# EAGLE design FSR-Sensor (EAGLE 9.5.0)
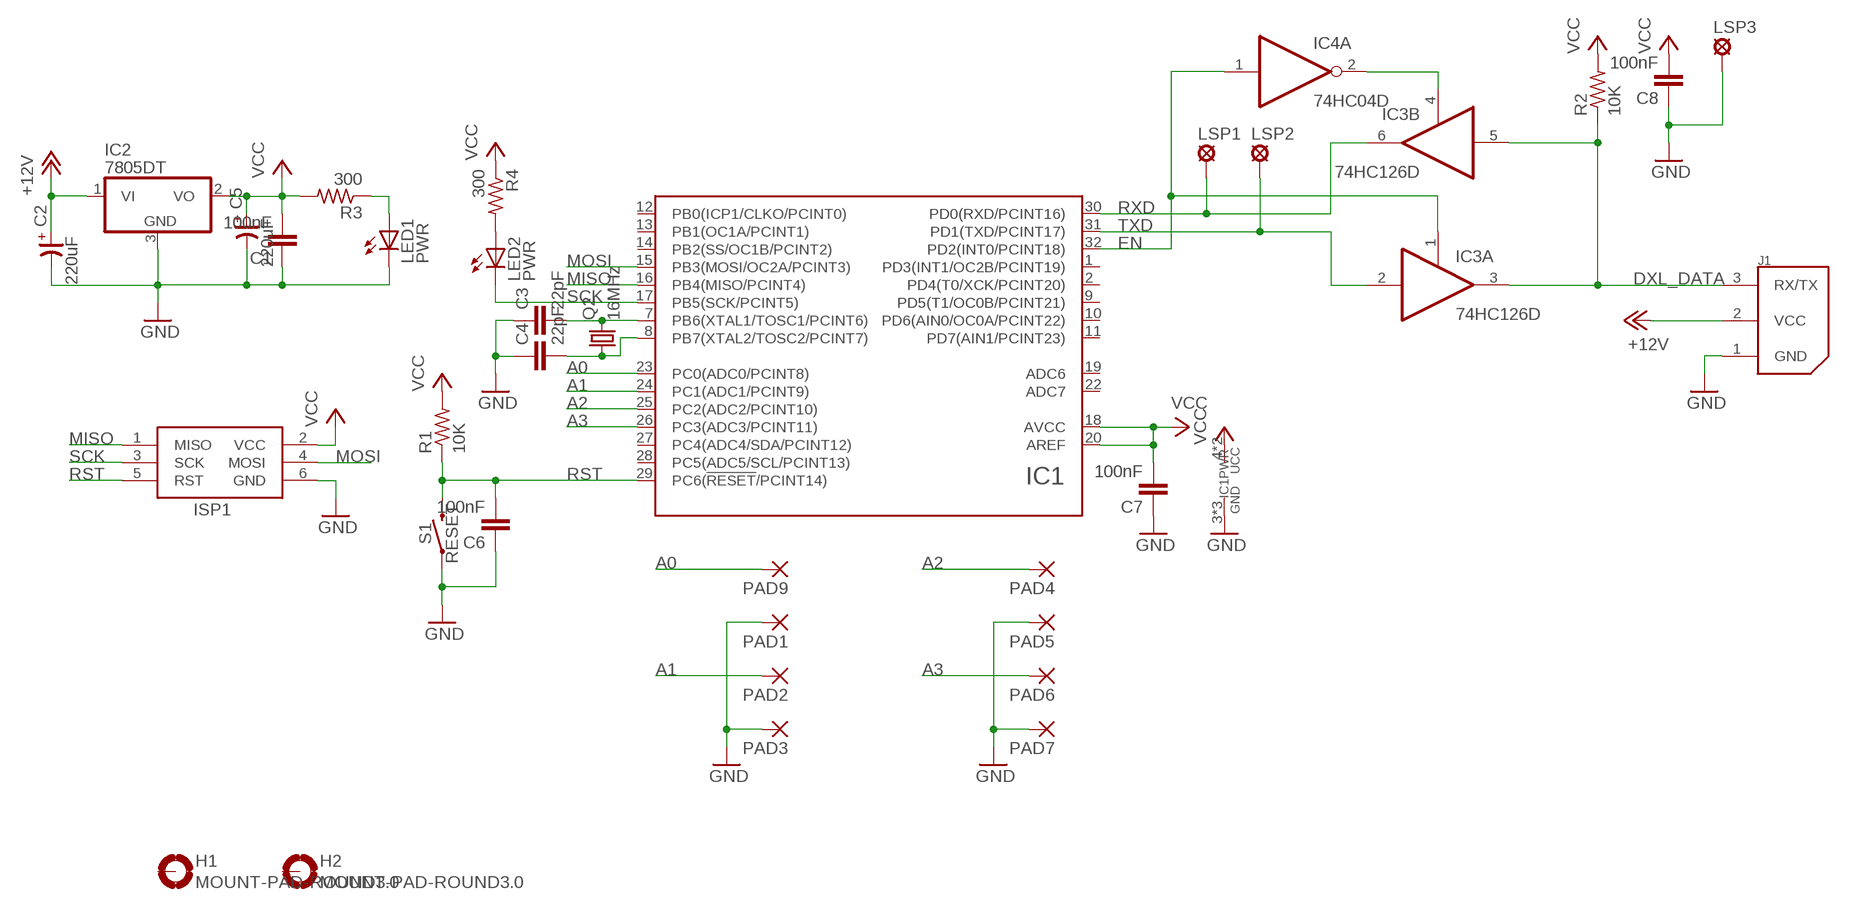
[diagram p0: schematic, sheet 1]

## Parts
C1  100nF  C-EUC0805K  [C0805K]
C2  220uF  CP-7343  [7343/T]
C3  22pF  C-EUC0805K  [C0805K]
C4  22pF  C-EUC0805K  [C0805K]
C5  220uF  CP-7343  [7343/T]
C6  100nF  C-EUC0805K  [C0805K]
C7  100nF  C-EUC0805K  [C0805K]
C8  100nF  C-EUC0805K  [C0805K]
H1  MOUNT-PAD-ROUND3.0  [3,0-PAD]
H2  MOUNT-PAD-ROUND3.0  [3,0-PAD]
IC1  ATMEGA48/88/168/328-AU  [TQFP32-08]
IC2  7805DT  [TO252]
IC3  74HC126D  [SO14]
IC4  74HC04D  [SO14]
ISP1  AVRISP-6  [AVRISP]
J1  22-03-5035  [5267-3]
LED1  PWR  LEDCHIP-LED0805  [CHIP-LED0805]
LED2  PWR  LEDCHIP-LED0805  [CHIP-LED0805]
LSP1  LSP10  [LSP10]
LSP2  LSP10  [LSP10]
LSP3  LSP10  [LSP10]
PAD1  SMD2  [SMD1,27-2,54]
PAD2  SMD2  [SMD1,27-2,54]
PAD3  SMD2  [SMD1,27-2,54]
PAD4  SMD2  [SMD1,27-2,54]
PAD5  SMD2  [SMD1,27-2,54]
PAD6  SMD2  [SMD1,27-2,54]
PAD7  SMD2  [SMD1,27-2,54]
PAD9  SMD2  [SMD1,27-2,54]
Q2  16MHz  CRYSTALHC49UP  [HC49UP]
R1  10K  R-US_R0805  [R0805]
R2  10K  R-US_R0805  [R0805]
R3  300  R-US_R0805  [R0805]
R4  300  R-US_R0805  [R0805]
S1  RESET  MOMENTARY-SWITCH-SPST-SMD-6.0X3.5MM  [TACTILE_SWITCH_SMD_6.0X3.5MM]

## Nets
+12V: C2.+ IC2.1(VI) J1.2(VCC)
A0: IC1.23(PC0(ADC0/PCINT8)) PAD9.1(P)
A1: IC1.24(PC1(ADC1/PCINT9)) PAD2.1(P)
A2: IC1.25(PC2(ADC2/PCINT10)) PAD4.1(P)
A3: IC1.26(PC3(ADC3/PCINT11)) PAD6.1(P)
DXL_DATA: IC3.3(A:O) IC3.5(B:I) J1.3(RX/TX) R2.1
EN: IC1.32(PD2(INT0/PCINT18)) IC3.1(A:OE) IC4.1(A:I)
GND: C1.1 C2.- C3.1 C4.1 C5.- C6.1 C7.1 C8.1 IC1.3(GND) IC1.5(GND) IC1.21(GND) IC2.3(GND) ISP1.6(GND) J1.1(GND) LED1.C LSP3.MP PAD1.1(P) PAD3.1(P) PAD5.1(P) PAD7.1(P) S1.1
MISO: IC1.16(PB4(MISO/PCINT4)) ISP1.1(MISO)
MOSI: IC1.15(PB3(MOSI/OC2A/PCINT3)) ISP1.4(MOSI)
N$1: C3.2 IC1.7(PB6(XTAL1/TOSC1/PCINT6)) Q2.2
N$2: C4.2 IC1.8(PB7(XTAL2/TOSC2/PCINT7)) Q2.1
N$3: LED1.A R3.1
N$4: LED2.A R4.2
N$6: IC3.4(B:OE) IC4.2(A:O)
RST: C6.2 IC1.29(PC6(!RESET!/PCINT14)) ISP1.5(RST) R1.1 S1.2
RXD: IC1.30(PD0(RXD/PCINT16)) IC3.6(B:O) LSP1.MP
SCK: IC1.17(PB5(SCK/PCINT5)) ISP1.3(SCK) LED2.C
TXD: IC1.31(PD1(TXD/PCINT17)) IC3.2(A:I) LSP2.MP
VCC: C1.2 C5.+ C7.2 C8.2 IC1.4(UCC) IC1.6(UCC) IC1.18(AVCC) IC1.20(AREF) IC2.2(VO) ISP1.2(VCC) R1.2 R2.2 R3.2 R4.1
Unconnected: H1.B3,0(MOUNT) H2.B3,0(MOUNT) IC1.1(PD3(INT1/OC2B/PCINT19)) IC1.2(PD4(T0/XCK/PCINT20)) IC1.9(PD5(T1/OC0B/PCINT21)) IC1.10(PD6(AIN0/OC0A/PCINT22)) IC1.11(PD7(AIN1/PCINT23)) IC1.12(PB0(ICP1/CLKO/PCINT0)) IC1.13(PB1(OC1A/PCINT1)) IC1.14(PB2(SS/OC1B/PCINT2)) IC1.19(ADC6) IC1.22(ADC7) IC1.27(PC4(ADC4/SDA/PCINT12)) IC1.28(PC5(ADC5/SCL/PCINT13)) IC3.8(C:O) IC3.9(C:I) IC3.10(C:OE) IC3.11(D:O) IC3.12(D:I) IC3.13(D:OE) IC4.3(B:I) IC4.4(B:O) IC4.5(C:I) IC4.6(C:O) IC4.8(D:O) IC4.9(D:I) IC4.10(E:O) IC4.11(E:I) IC4.12(F:O) IC4.13(F:I)

## Power pins joined to a net without a drawn wire
GND: IC3.7(P:GND) IC4.7(P:GND)
VCC: IC3.14(P:VCC) IC4.14(P:VCC)

## Library data of the parts
C1 C3 C4 C6-C8 = rcl:C-EU: CAPACITOR, European symbol; SPICEPREFIX: C
C2 C5 = cap-master:CP-: POLARIZED CAP
H1 H2 = holes:MOUNT-PAD-ROUND: MOUNTING PAD, round
IC1 = atmel_tiny24-44-84tiny48-88mega48-88-168-328:ATMEGA48/88/168/328
IC2 = linear:78*: Positive VOLTAGE REGULATOR Source: http://cache.national.com/ds/LM/LM78L05.pdf http://www.fairchildsemi.com/ds/LM/LM7805.pdf
IC3 = 74xx-eu:74*126: Quad bus BUFFER, 3-state
IC4 = 74xx-eu:74*04: Hex INVERTER
ISP1 = adafruit:AVRISP: AVR ISP HEADER Standard 6 pin header for AVR programming
J1 = molex:22-03-5035: Molex SPOX Vert, Tin (Dynamixel AX/MX Bus) tested: YES (arbotix)
LED1 LED2 = adafruit:LED: LED OSRAM: - CHIPLED LG R971, LG N971, LY N971, LG Q971, LY Q971, LO R971, LY R971 LH N974, LH R974 LS Q976, LO Q976, LY Q976 LO Q996 - Hyper CHIPLED LW Q18S LB Q993, LB Q99A, LB R99A - SideLED LS A670, LO A670, LY A670, LG A670, LP A670 LB A673, LV A673, LT A673, LW A673 LH A674 LY A675 LS A676, LA A676, LO A676, LY A676, LW A676 LS A679, LY A679, LG A679 - Hyper Micro SIDELED® LS Y876, LA Y876, LO Y876, LY Y876 LT Y87S - SmartLED LW L88C, LW L88S LB L89C, LB L89S, LG L890 LS L89K, LO L89K, LY L89K LS L896, LA L896, LO L896, LY L896 - TOPLED LS T670, LO T670, LY T670, LG T670, LP T670 LSG T670, LSP T670, LSY T670, LOP T670, LYG T670 LG T671, LOG T671, LSG T671 LB T673, LV T673, LT T673, LW T673 LH T674 LS T676, LA T676, LO T676, LY T676, LB T676, LH T676, LSB T676, LW T676 LB T67C, LV T67C, LT T67C, LS T67K, LO T67K, LY T67K, LW E67C LS E67B, LA E67B, LO E67B, LY E67B, LB E67C, LV E67C, LT E67C LW T67C LS T679, LY T679, LG T679 LS T770, LO T770, LY T770, LG T770, LP T770 LB T773, LV T773, LT T773, LW T773 LH T774 LS E675, LA E675, LY E675, LS T675 LS T776, LA T776, LO T776, LY T776, LB T776 LHGB T686 LT T68C, LB T68C - Hyper Mini TOPLED® LB M676 - Mini TOPLED Santana® LG M470 LS M47K, LO M47K, LY M47K Source: http://www.osram.convergy.de/
LSP1-LSP3 = solpad:LSP10: SOLDER PAD drill 1.0 mm, distributor Buerklin, 12H555
PAD1-PAD7 PAD9 = wirepad:SMD2: SMD PAD
Q2 = crystal:CRYSTAL: CRYSTAL; OC_FARNELL: unknown; OC_NEWARK: unknown
R1-R4 = rcl:R-US_: RESISTOR, American symbol; SPICEPREFIX: R
S1 = SparkFun-Switches:MOMENTARY-SWITCH-SPST: Momentary Switch (Pushbutton) - SPST Normally-open (NO) SPST momentary switches (buttons, pushbuttons). Variants PTH-12MM - 12mm square, through-hole Momentary Pushbutton Switch - 12mm Square <https://www.sparkfun.com/products/9190> (COM-09190) PTH-6.0MM, PTH-6.0MM-KIT - 6.0mm square, through-hole Mini Pushbutton Switch <https://www.sparkfun.com/products/97> (COM-00097) KIT package intended for soldering kit's - only one side of pads' copper is exposed. PTH-RIGHT-ANGLE-KIT - Right-angle, through-hole Right Angle Tactile Button <https://www.sparkfun.com/products/10791> - Used on SparkFun BigTime Watch Kit <https://www.sparkfun.com/products/11734> SMD-12MM - 12mm square, surface-mount Tactile Button - SMD (12mm) <https://www.sparkfun.com/products/12993> (COM-12993) Used on SparkFun PicoBoard <https://www.sparkfun.com/products/11888> SMD-4.5MM - 4.5mm Square Trackball Switch Used on SparkFun Blackberry Trackballer Breakout <https://www.sparkfun.com/products/13169> SMD-4.6MMX2.8MM - 4.60mm x 2.80mm, surface mount Used on SparkFun SAMD21 Mini Breakout <https://www.sparkfun.com/products/13664> SMD-5.2MM, SMD-5.2-REDUNDANT - 5.2mm square, surface-mount Mini Pushbutton Switch - SMD <https://www.sparkfun.com/products/8720> (COM-08720) Used on Arduino Pro Mini <https://www.sparkfun.com/products/11114> REDUNDANT package connects both switch circuits together SMD-6.0X3.5MM - 6.0 x 3.5mm, surface mount Momentary Reset Switch SMD <https://www.sparkfun.com/products/8229> (COM-08229) SMD-6.2MM-TALL - 6.2mm square, surface mount Tactile Button - SMD (6mm) <https://www.sparkfun.com/products/12992> Used on SparkFun Digital Sandbox <https://www.sparkfun.com/products/12651> SMD-RIGHT-ANGLE - Right-angle, surface mount Used on SparkFun Block for Intel® Edison - Arduino <https://www.sparkfun.com/products/13036>; PROD_ID: SWCH-00815; SF_SKU: COM-08229

## Board
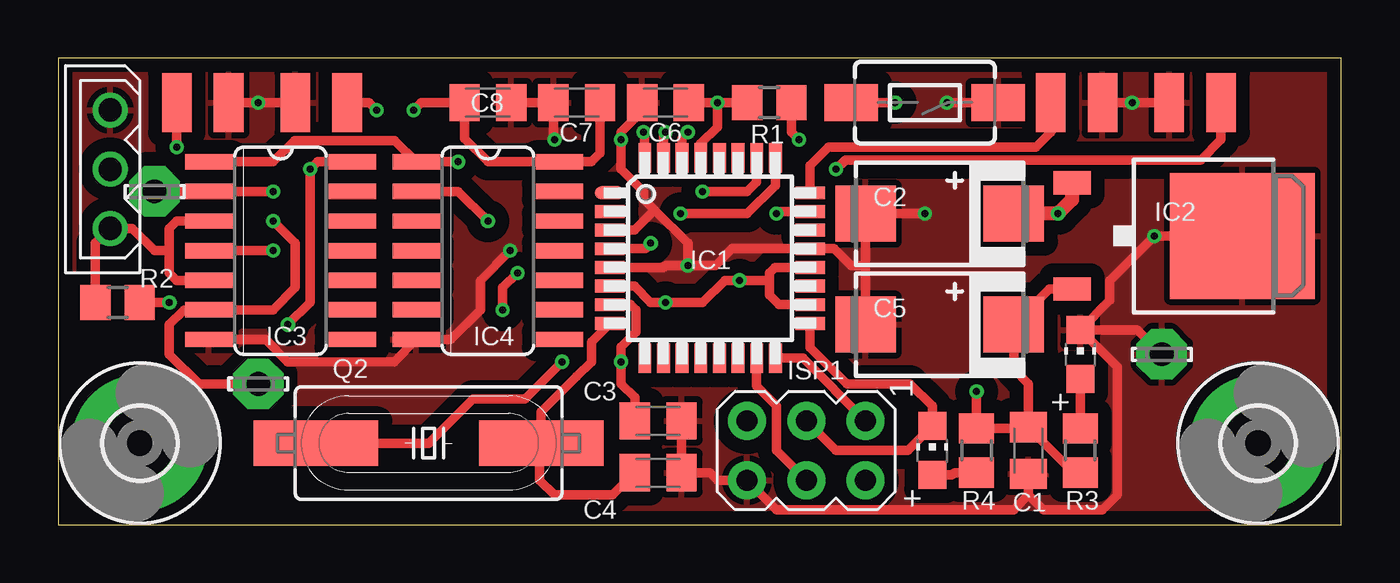
[diagram p1: board, top side]
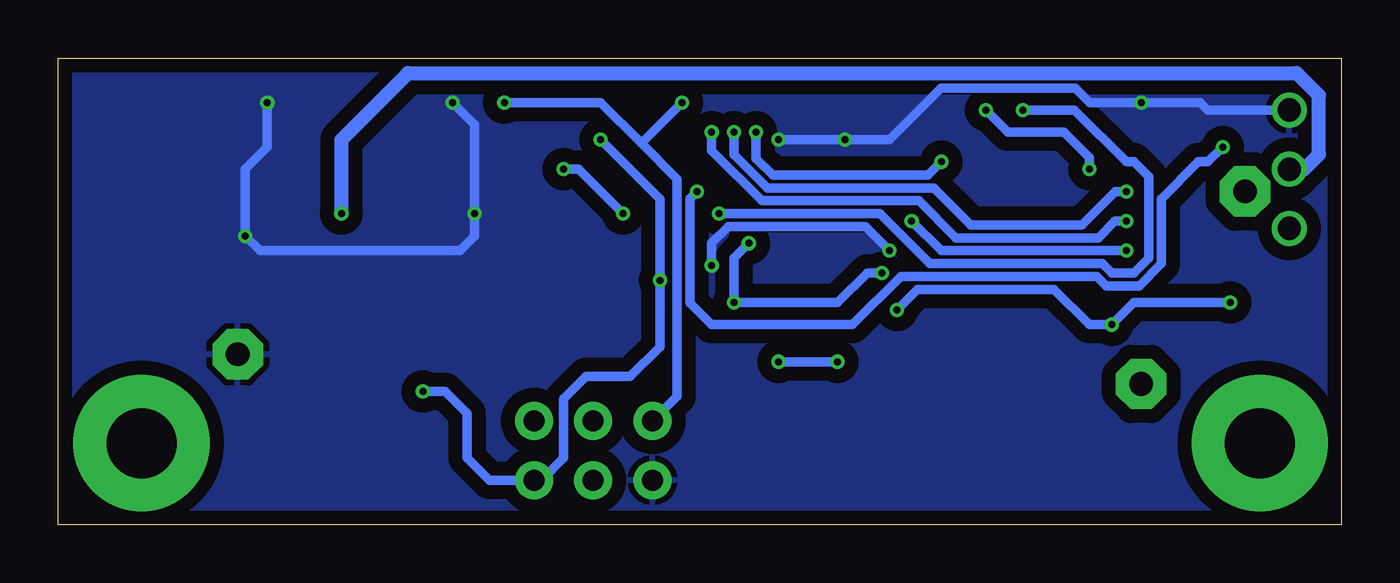
[diagram p2: board, bottom side, seen from below]

Size 55 x 20 mm. Coordinates in mm from the lower left corner, seen from the top.
Outline: 0,0 55,0 55,20 0,20 0,0
Copper layers (1*16): Top 0.035mm / dielectric 1.5mm / Bottom 0.035mm
Design rules "SparkFun-2-layer-PCBWay-LIMIT": minimum track width 6mil, minimum drill 0.3mm, track to track 6mil, track to pad 6mil, pad to pad 6mil, via to via 6mil, smd to smd 6mil, copper to edge 6mil, drill to drill 6mil, minimum pad ring 6mil, minimum via ring 6mil, stop-mask expansion 4mil, vias tented up to drill 25mil, thermal gap 10mil

### Footprints (pad centres in the part's own frame; a part is rotated, then mirrored left to right if it is on the bottom)
C0805K = smd 1.3 x 1.6: 1 -1,0; 2 1,0
7343/T = smd 2.6 x 2.4: + 3.175,0; - -3.175,0
3,0-PAD = drill 3 pad 5.842: B3,0 0,0
TQFP32-08 = smd 1.27 x 0.55: 1 -4.293,2.8; 2 -4.293,2; 3 -4.293,1.2; 4 -4.293,0.4; 5 -4.293,-0.4; 6 -4.293,-1.2; 7 -4.293,-2; 8 -4.293,-2.8; 17 4.293,-2.8; 18 4.293,-2; 19 4.293,-1.2; 20 4.293,-0.4; 21 4.293,0.4; 22 4.293,1.2; 23 4.293,2; 24 4.293,2.8 | smd 0.55 x 1.27: 9 -2.8,-4.293; 10 -2,-4.293; 11 -1.2,-4.293; 12 -0.4,-4.293; 13 0.4,-4.293; 14 1.2,-4.293; 15 2,-4.293; 16 2.8,-4.293; 25 2.8,4.293; 26 2,4.293; 27 1.2,4.293; 28 0.4,4.293; 29 -0.4,4.293; 30 -1.2,4.293; 31 -2,4.293; 32 -2.8,4.293
TO252 = smd 1 x 1.6: 1 -2.28,-4.8; 2 2.28,-4.8 | smd 5.4 x 6.2: 3 0,2.5
SO14 = smd 0.66 x 2.032: 1 -3.81,-3.073; 2 -2.54,-3.073; 3 -1.27,-3.073; 4 0,-3.073; 5 1.27,-3.073; 6 2.54,-3.073; 7 3.81,-3.073; 8 3.81,3.073; 9 2.54,3.073; 10 1.27,3.073; 11 0,3.073; 12 -1.27,3.073; 13 -2.54,3.073; 14 -3.81,3.073
AVRISP = drill 0.9 pad 1.626: 1 -1.27,2.54; 2 1.27,2.54; 3 -1.27,0; 4 1.27,0; 5 -1.27,-2.54; 6 1.27,-2.54
5267-3 = drill 1: 1 0,0; 2 -2.54,0; 3 -5.08,0
CHIP-LED0805 = smd 1.2 x 1.2: A 0,-1.05; C 0,1.05
LSP10 = drill 1.016 pad 2.159 octagon: MP 0,0
SMD1,27-2,54 = smd 1.27 x 2.54: 1 0,0
HC49UP = smd 5.334 x 1.93: 1 -4.826,0; 2 4.826,0
R0805 = smd 1.3 x 1.5: 1 -0.95,0; 2 0.95,0
TACTILE_SWITCH_SMD_6.0X3.5MM = smd 2.3 x 1.6: 1 -3.15,0; 2 3.15,0

### Placement (x,y rotation side)
C1  41.59,3.17 90 top
C2  37.78,13.34 0 top
C3  25.72,4.45 180 top
C4  25.72,2.22 180 top
C5  37.78,8.57 0 top
C6  26.04,18.1 0 top
C7  22.23,18.1 0 top
C8  18.41,18.1 180 top
H1  3.49,3.49 0 top
H2  51.44,3.49 0 top
IC1  27.94,11.43 0 top
IC2  48.26,12.38 270 top
IC3  9.53,11.75 270 top
IC4  18.41,11.75 270 top
ISP1  32.07,3.17 270 top
J1  2.22,17.78 90 top
LED1  43.81,7.3 0 top
LED2  37.47,3.17 0 top
LSP1  8.57,6.03 0 top
LSP2  4.13,14.29 0 top
LSP3  47.31,7.3 0 top
PAD1  47.62,18.1 180 top
PAD2  42.55,18.1 180 top
PAD3  44.77,18.1 180 top
PAD4  12.38,18.1 180 top
PAD5  10.16,18.1 180 top
PAD6  5.08,18.1 180 top
PAD7  7.3,18.1 180 top
PAD9  49.85,18.1 0 top
Q2  15.88,3.49 180 top
R1  30.48,18.1 0 top
R2  2.54,9.53 0 top
R3  43.81,3.17 270 top
R4  39.37,3.17 270 top
S1  37.15,18.1 180 top

### Tracks (layer width: path | path; a pad name or v marks a point on that pad's centre or on a via)
+12V  (via drill 0.3)
  Top 0.6: IC2.1 43.46,13.93 v42.86,13.34 C2.+
  Bottom 0.6: J1.2 1.59,15.24 0.95,15.88 0.95,18.41 1.91,19.37 40.01,19.37 42.86,16.51 v42.86,13.34
A0  (via drill 0.3)
  Top 0.4: PAD9.1 49.85,16.51 48.98,15.64 33.74,15.64 v33.34,15.24 | IC1.23 30.89,13.43 v30.8,13.34
  Bottom 0.4: v30.8,13.34 32.7,15.24 v33.34,15.24
A1
  Top 0.4: PAD2.1 42.55,16.83 41.91,16.19 33.02,16.19 32.23,15.4 IC1.24
A2  (via drill 0.3)
  Top 0.4: IC1.25 30.74,14.55 29.53,13.34 v26.67,13.34 | PAD4.1 13.34,18.1 v13.65,17.78
  Bottom 0.4: v26.67,13.34 19.77,13.34 17.63,11.2 10.24,11.2 9.84,10.79 8.89,10.79 8.26,11.43 8.26,14.92 8.89,15.56 9.21,15.56 11.43,17.78 v13.65,17.78
A3  (via drill 0.3)
  Top 0.4: IC1.26 29.94,14.7 29.53,14.29 v27.62,14.29 | PAD6.1 v5.08,16.19
  Bottom 0.4: v27.62,14.29 27.93,13.98 27.93,9.51 26.99,8.57 20.95,8.57 18.89,10.64 10.47,10.64 10.07,10.24 8.66,10.24 7.7,11.2 7.7,13.97 6.12,15.56 5.71,15.56 v5.08,16.19
DXL_DATA
  Top 0.4: IC3.3 5.08,13.02 4.76,12.7 4.76,11.75 | 4.76,11.75 4.76,10.79 5.08,10.48 IC3.5 | 4.76,11.75 4.13,11.75 3.17,12.7 J1.3 1.59,12.07 R2.1
EN  (via drill 0.3)
  Top 0.4: IC3.1 9.21,15.56 10.12,16.48 14.42,16.48 IC4.1 v17.14,15.56 | IC1.32 25.14,16.77 v25.08,16.83
  Bottom 0.4: v17.14,15.56 17.71,14.99 24.37,14.99 25.08,15.7 v25.08,16.83
GND  (via drill 0.3)
  Top 0.4: PAD7.1 v8.57,18.1 PAD5.1 | PAD1.1 v46.04,18.1 PAD3.1 | 34.61,11.11 C2.- v37.15,13.34 | 34.61,11.11 C5.- | 34.61,11.11 33.97,11.11 33.26,11.83 IC1.21 28.89,11.83 28.18,11.11 v26.99,11.11 | C3.1 C4.1 27.94,2.22 28.26,1.91 ISP1.6 30.8,0.64 40.96,0.64 41.59,1.27 | IC3.7 8.89,7.94 9.84,6.99 14.39,6.99 IC4.7 16.83,7.94 18.1,9.21 18.1,10.48 v19.37,11.75 | C8.1 C7.1 21.23,16.56 v21.27,16.51 | v38.1,18.1 S1.1 | IC2.3 v46.99,12.38 45.09,10.48 45.09,9.62 LED1.C | C1.1 41.59,1.27 | 41.59,1.27 42.23,0.64 44.77,0.64 45.4,1.27 45.4,6.76 LED1.C | C6.1 25.04,17.73 24.13,16.83 v24.13,16.51 24.13,15.24 25.08,14.29 25.08,13.97 25.56,13.49 | 25.56,13.49 26.99,12.06 v26.99,11.11 | IC1.5 25.95,11.03 26.04,11.11 v26.99,11.11 | IC1.3 24.7,12.63 25.56,13.49 | LSP3.MP 46.26,8.35 LED1.C
  Bottom 0.4: J1.1 5.71,17.78 6.03,18.1 v8.57,18.1 10.78,18.1 11.39,18.71 17.16,18.71 19.37,16.51 v21.27,16.51 v24.13,16.51 | v38.1,18.1 37.15,17.14 v37.15,13.34 37.15,12.38 37.78,11.75 46.35,11.75 v46.99,12.38 46.99,15.24 46.04,16.19 v46.04,18.1 | v19.37,11.75 20.4,12.78 26.27,12.78 26.99,12.06 v26.99,11.11
  pour Top (isolate 0.6): 0,20 0,0 55,0 55,20
  pour Bottom (isolate 0.6): 0,20 0,0 55,0 55,20
MISO
  Top 0.4: IC1.16 31.91,7.14 ISP1.1
MOSI
  Top 0.4: IC1.15 29.94,5.94 30.8,5.08 30.8,3.17 ISP1.4
N$1  (via drill 0.3)
  Top 0.4: IC1.7 24.54,9.43 24.77,9.21 24.77,8.26 24.13,7.62 v24.13,6.99 24.13,6.03 24.72,5.45 C3.2 | Q2.2 15.88,3.49 17.78,5.4 20,5.4 v21.59,6.99
  Bottom 0.4: v21.59,6.99 v24.13,6.99
N$2
  Top 0.4: IC1.8 22.86,7.84 22.86,6.99 22.23,6.35 20.7,4.83 Q2.1 20.64,3.43 20.64,1.91 21.27,1.27 23.77,1.27 C4.2
N$3
  Top 0.4: R3.1 LED1.A
N$4
  Top 0.4: LED2.A 38.32,2.12 38.42,2.23 R4.2
N$6  (via drill 0.3)
  Top 0.4: IC4.2 17.14,14.29 v18.41,13.02 | IC3.4 v9.21,11.75
  Bottom 0.4: v18.41,13.02 17.14,11.75 v9.21,11.75
RST  (via drill 0.3)
  Top 0.4: C6.2 v28.26,18.1 | v28.26,18.1 R1.1 | S1.2 v35.88,18.1 | v28.26,18.1 28.26,17.05 27.54,16.33 IC1.29
  Bottom 0.4: v35.88,18.1 31.75,18.1 30,16.35 | 30,16.35 28.48,14.83 28.48,5.49 ISP1.5 | v28.26,18.1 30,16.35
RXD  (via drill 0.3)
  Top 0.4: IC1.30 26.74,16.58 v26.99,16.83 | v9.21,13.02 10.16,12.06 10.16,10.16 9.21,9.21 IC3.6 5.4,9.21 4.76,8.57 4.76,7.3 6.03,6.03 LSP1.MP
  Bottom 0.4: v26.99,16.83 26.99,16.05 24.83,13.89 18.1,13.89 16.51,12.3 10.41,12.3 9.7,13.02 v9.21,13.02
SCK
  Top 0.4: ISP1.3 33.34,3.17 36.41,3.17 LED2.C 37.47,5.08 36.51,6.03 33.8,6.03 32.23,7.6 IC1.17
TXD  (via drill 0.3)
  Top 0.4: IC1.31 25.94,16.73 v26.04,16.83 | v9.21,14.29 IC3.2 LSP2.MP
  Bottom 0.4: v26.04,16.83 26.04,15.88 24.6,14.44 17.46,14.44 15.88,12.85 11.11,12.85 9.68,14.29 v9.21,14.29
VCC  (via drill 0.3)
  Top 0.4: C1.2 43.54,2.23 R3.2 | IC2.2 42.49,10.1 C5.+ 40.96,6.67 41.59,6.03 C1.2 | C1.2 41.54,4.12 R4.1 v39.37,5.71 | IC1.18 30.89,9.43 30.48,9.84 30.48,10.48 | IC1.20 30.71,11.03 30.48,10.79 30.48,10.48 | 30.48,10.48 v29.21,10.48 28.57,10.48 27.62,9.53 v26.04,9.53 25.4,9.53 24.7,10.23 IC1.6 | R2.2 v4.76,9.53 | IC3.14 11.11,15.56 v10.79,15.24 10.79,9.53 v9.84,8.57 | R1.2 31.43,16.83 v31.75,16.51 | C7.2 23.23,15.92 22.86,15.56 IC4.14 18.41,15.56 17.41,16.56 C8.2 15.56,18.1 v15.24,17.78 | IC1.4 25.16,11.83 v25.4,12.06 | v19.05,9.21 19.05,10.16 v19.68,10.79
  Bottom 0.4: v39.37,5.71 38.42,5.71 37.47,4.76 37.47,2.86 36.51,1.91 ISP1.2 34.29,1.91 33.34,2.86 33.34,5.4 32.38,6.35 30.48,6.35 29.21,7.62 v29.21,10.48 29.21,13.97 v31.75,16.51 | v15.24,17.78 14.29,16.83 11.89,16.83 10.79,15.73 v10.79,15.24 | v4.76,9.53 8.89,9.53 v9.84,8.57 10.79,8.57 12.31,10.09 18.17,10.09 v19.05,9.21 | v25.4,12.06 26.04,11.43 v26.04,9.53 21.59,9.53 20.32,10.79 v19.68,10.79